# Altium schematic sheet 16 Ethernet.SchDoc
size 420 x 297 mm
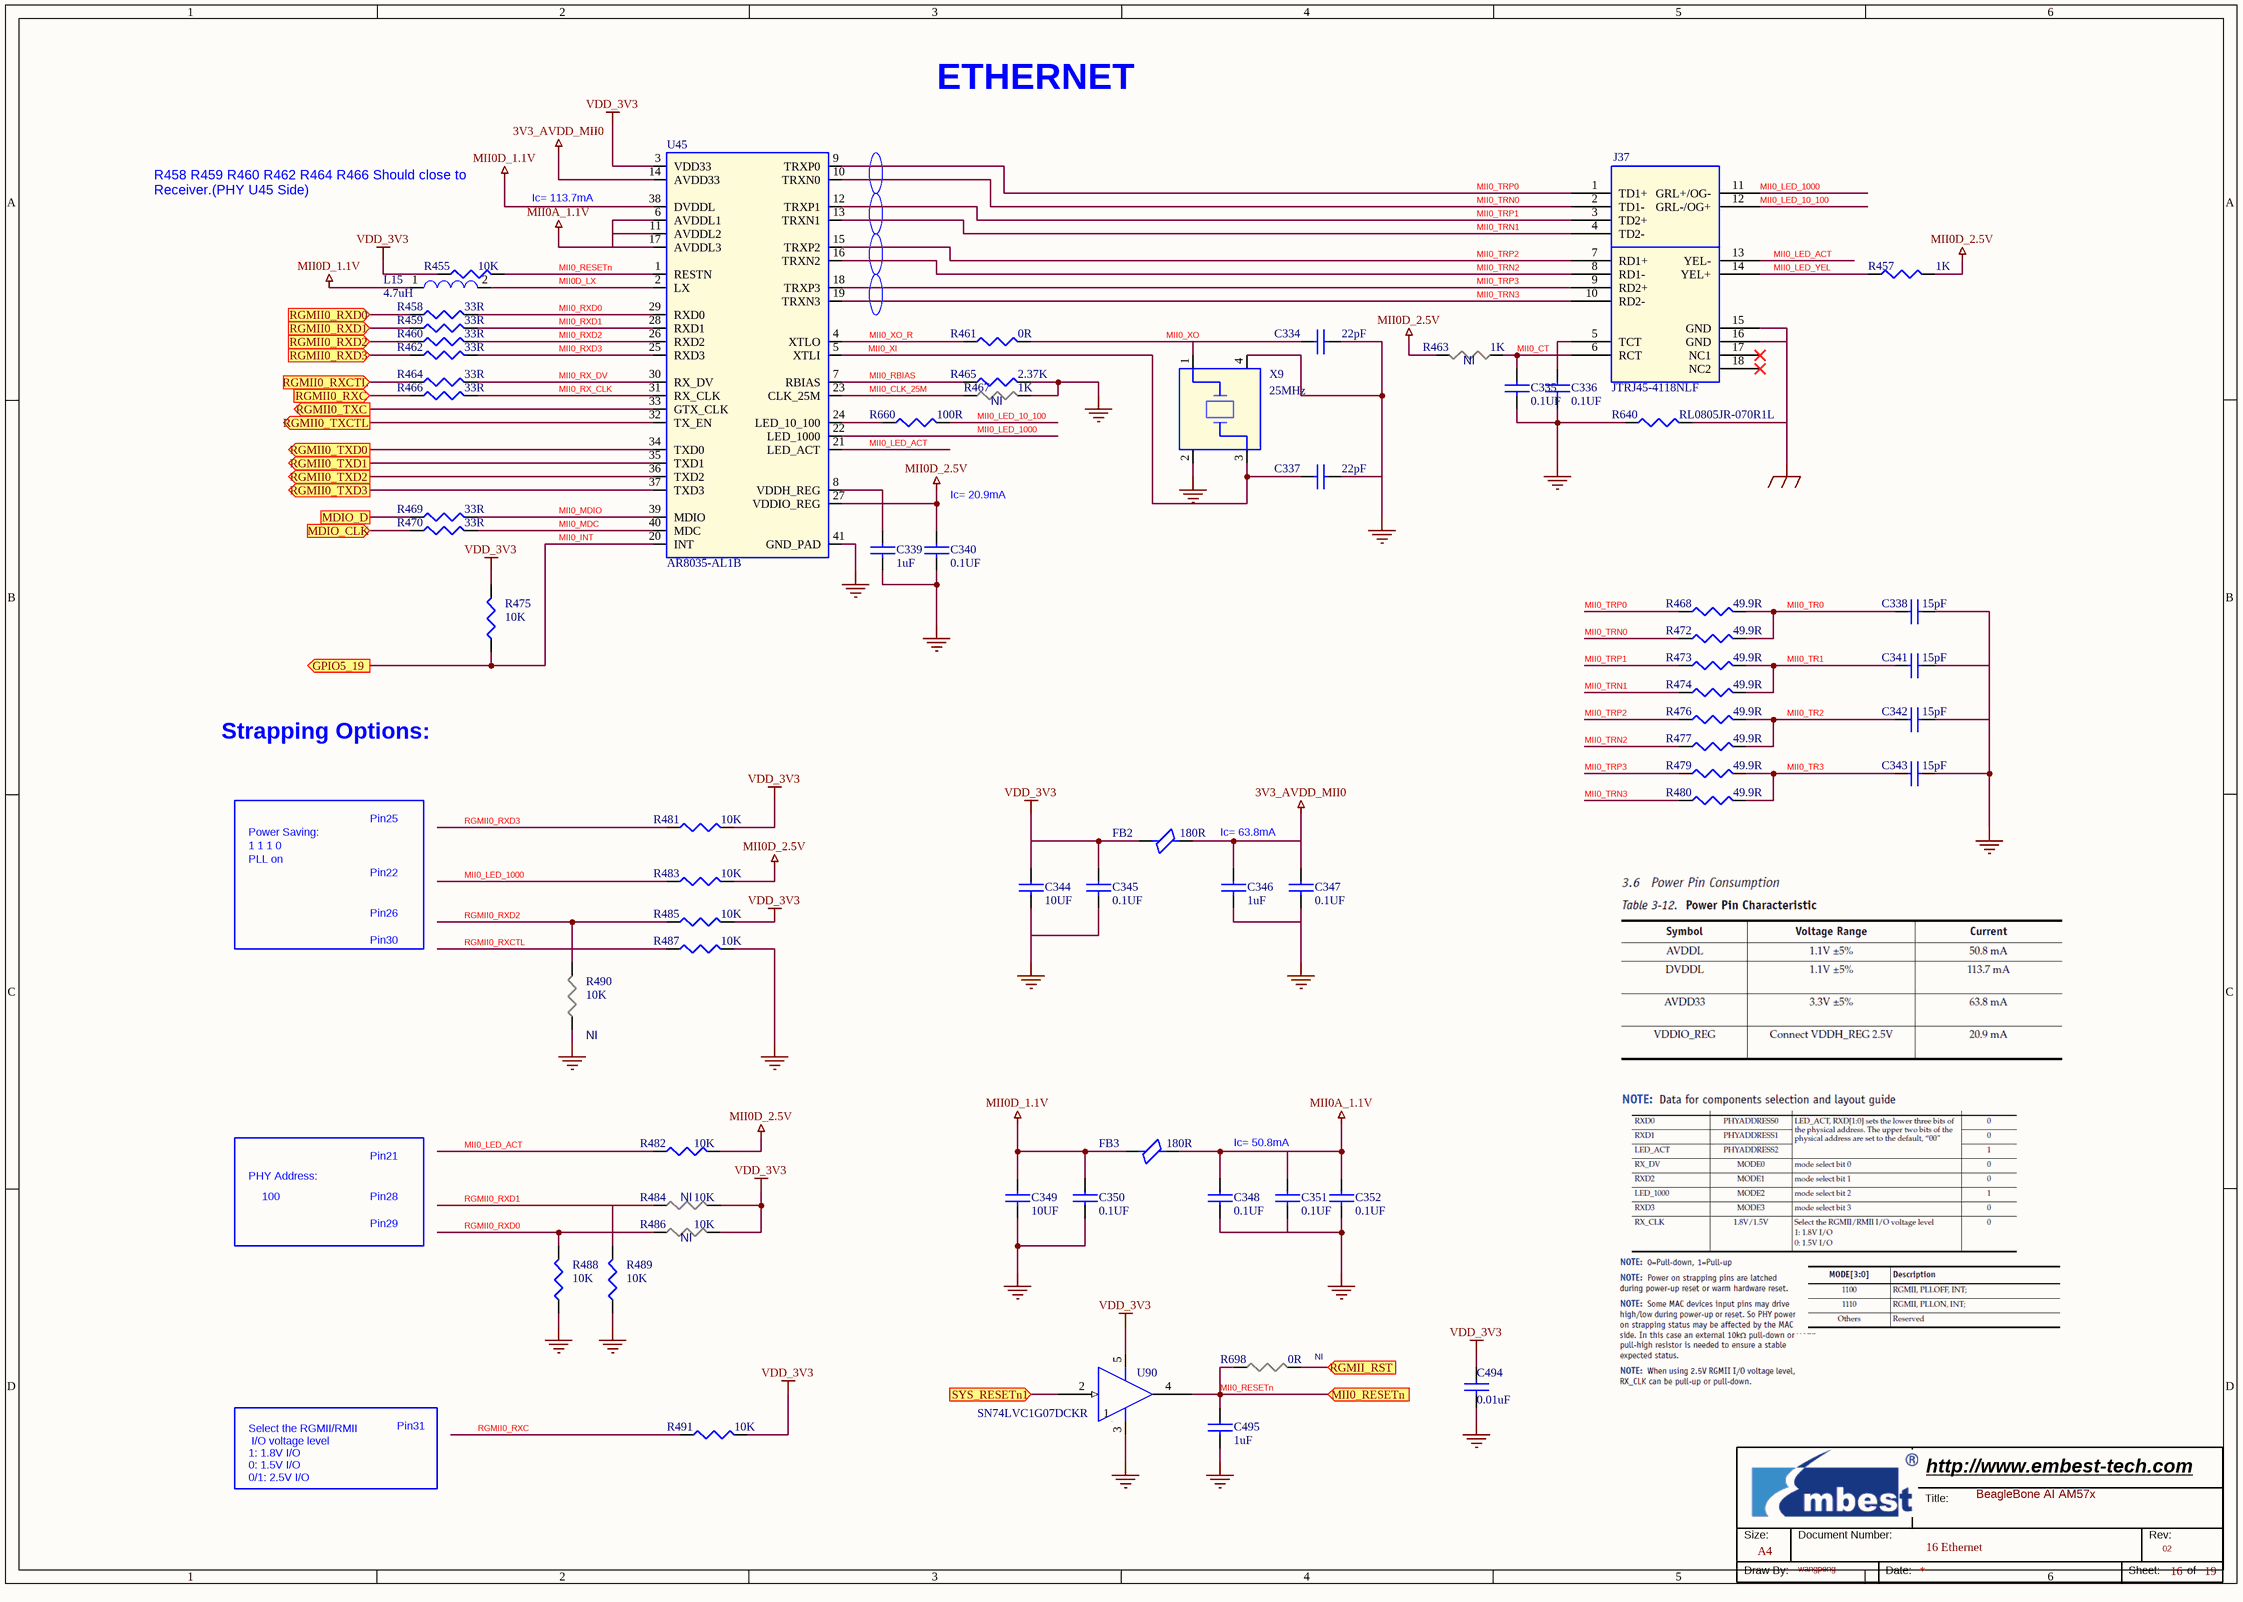
[diagram p0: 16 Ethernet.SchDoc]

## Parts
*  Page Count: 19  Page Number: 16  Page Size: A4  Title: BeagleBone AI AM57x  RevCode: 02  Doc: 16 Ethernet  Drawing: wangpeng  (hidden comment: Embest Title)  (graphical)
C334  22pF  [C0402]
C335  0.1UF  [C0402]
C336  0.1UF  [C0402]
C337  22pF  [C0402]
C338  15pF  [C0402]
C339  1uF  [C0402]
C340  0.1UF  [C0402]
C341  15pF  [C0402]
C342  15pF  [C0402]
C343  15pF  [C0402]
C344  10UF  [C0603]
C345  0.1UF  [C0402]
C346  1uF  [C0402]
C347  0.1UF  [C0402]
C348  0.1UF  [C0402]
C349  10UF  [C0603]
C350  0.1UF  [C0402]
C351  0.1UF  [C0402]
C352  0.1UF  [C0402]
C494  0.01uF  [C0402]
C495  1uF  [C0402]
FB2  180R  [L0603]
FB3  180R  [L0603]
J37  JTRJ45-4118NLF  [RJ45_MTCONN_JTRJ45-4118NLF]
L15  4.7uH  [L30X30_A]
R455  10K  [R0402]
R457  1K  [R0402]
R458  33R  [R0402]
R459  33R  [R0402]
R460  33R  [R0402]
R461  0R  [R0402]
R462  33R  [R0402]
R463  1K  ASSY: NI  [R0402]
R464  33R  [R0402]
R465  2.37K  [R0402]
R466  33R  [R0402]
R467  1K  ASSY: NI  [R0402]
R468  49.9R  [R0402]
R469  33R  [R0402]
R470  33R  [R0402]
R472  49.9R  [R0402]
R473  49.9R  [R0402]
R474  49.9R  [R0402]
R475  10K  [R0402]
R476  49.9R  [R0402]
R477  49.9R  [R0402]
R479  49.9R  [R0402]
R480  49.9R  [R0402]
R481  10K  [R0402]
R482  10K  [R0402]
R483  10K  [R0402]
R484  10K  ASSY: NI  [R0402]
R485  10K  [R0402]
R486  10K  ASSY: NI  [R0402]
R487  10K  [R0402]
R488  10K  [R0402]
R489  10K  [R0402]
R490  10K  ASSY: NI  [R0402]
R491  10K  [R0402]
R640  RL0805JR-070R1L  [R0805]
R660  100R  [R0402]
R698  0R  ASSY: NI  [R0402]
U45  AR8035-AL1B  [QFN40_1P4H]
U90  SN74LVC1G07DCKR  [SC70_5]
X9  25MHz  [OSCCC250x200x60-4N]

## Ports
GPIO5_19 (out), MDIO_CLK (in), MDIO_D, MII0_RESETn (in), RGMII0_RXC (in), RGMII0_RXCTL (in), RGMII0_RXD0 (in), RGMII0_RXD1 (in), RGMII0_RXD2 (in), RGMII0_RXD3 (in), RGMII0_TXC (out), RGMII0_TXCTL (out), RGMII0_TXD0 (out), RGMII0_TXD1 (out), RGMII0_TXD2 (out), RGMII0_TXD3 (out), RGMII_RST (in), SYS_RESETn1 (in)

## Nets
3V3_AVDD_MII0: C346.1 C347.1 FB2.2 U45.14(AVDD33)
GND: C334.2 C335.2 C336.2 C337.2 C338.2 C339.2 C340.2 C341.2 C342.2 C343.2 C344.2 C345.2 C346.2 C347.2 C348.2 C349.2 C350.2 C351.2 C352.2 C494.2 C495.2 R465.2 R467.2 R487.2 R488.1 R489.1 R490.1 R640.1 U45.41(GND_PAD) U90.3(GND) X9.2 X9.4
GND_EARTH: J37.15(GND) J37.16(GND) R640.2
MII0A_1.1V: C348.1 C351.1 C352.1 FB3.2 U45.6(AVDDL1) U45.11(AVDDL2) U45.17(AVDDL3)
MII0D_1.1V: C349.1 C350.1 FB3.1 L15.1 U45.38(DVDDL)
MII0D_2.5V: C340.1 R457.2 R463.2 R482.2 R483.2 U45.27(VDDIO_REG)
VDD_3V3: C344.1 C345.1 C494.1 FB2.1 R455.1 R475.2 R481.2 R484.2 R485.2 R486.2 R491.2 U45.3(VDD33) U90.5(VCC)
MDIO_CLK: R470.1 ; port MDIO_CLK
MDIO_D: R469.1 ; port MDIO_D
MII0_CLK_25M: R467.1 U45.23(CLK_25M)
MII0_CT: C335.1 J37.6(RCT) R463.1
MII0_INT: R475.1 U45.20(INT) ; port GPIO5_19
MII0_LED_10_100: J37.12(GRL-/OG+) R660.2
MII0_LED_1000: J37.11(GRL+/OG-) R483.1 U45.22(LED_1000)
MII0_LED_ACT: J37.13(YEL-) R482.1 U45.21(LED_ACT)
MII0_LED_YEL: J37.14(YEL+) R457.1
MII0_MDC: R470.2 U45.40(MDC)
MII0_MDIO: R469.2 U45.39(MDIO)
MII0_RBIAS: R465.1 U45.7(RBIAS)
MII0_RESETn: C495.1 R455.2 R698.1 U45.1(RESTN) U90.4(Y) ; port MII0_RESETn
MII0_RX_CLK: R466.2 U45.31(RX_CLK)
MII0_RX_DV: R464.2 U45.30(RX_DV)
MII0_RXD0: R458.2 U45.29(RXD0)
MII0_RXD1: R459.2 U45.28(RXD1)
MII0_RXD2: R460.2 U45.26(RXD2)
MII0_RXD3: R462.2 U45.25(RXD3)
MII0_TR0: C338.1 R468.2 R472.2
MII0_TR1: C341.1 R473.2 R474.2
MII0_TR2: C342.1 R476.2 R477.2
MII0_TR3: C343.1 R479.2 R480.2
MII0_TRN0: J37.2(TD1-) R472.1 U45.10(TRXN0)
MII0_TRN1: J37.4(TD2-) R474.1 U45.13(TRXN1)
MII0_TRN2: J37.8(RD1-) R477.1 U45.16(TRXN2)
MII0_TRN3: J37.10(RD2-) R480.1 U45.19(TRXN3)
MII0_TRP0: J37.1(TD1+) R468.1 U45.9(TRXP0)
MII0_TRP1: J37.3(TD2+) R473.1 U45.12(TRXP1)
MII0_TRP2: J37.7(RD1+) R476.1 U45.15(TRXP2)
MII0_TRP3: J37.9(RD2+) R479.1 U45.18(TRXP3)
MII0_XI: C337.1 U45.5(XTLI) X9.3
MII0_XO: C334.1 R461.2 X9.1
MII0_XO_R: R461.1 U45.4(XTLO)
MII0D_LX: L15.2 U45.2(LX)
RGMII0_RXC: R466.1 ; port RGMII0_RXC
RGMII0_RXC: R491.1  [a separate net that carries the same name]
RGMII0_RXCTL: R487.1
RGMII0_RXCTL: R464.1 ; port RGMII0_RXCTL  [a separate net that carries the same name]
RGMII0_RXD0: R486.1 R488.2
RGMII0_RXD0: R458.1 ; port RGMII0_RXD0  [a separate net that carries the same name]
RGMII0_RXD1: R484.1 R489.2
RGMII0_RXD1: R459.1 ; port RGMII0_RXD1  [a separate net that carries the same name]
RGMII0_RXD2: R460.1 ; port RGMII0_RXD2
RGMII0_RXD2: R485.1 R490.2  [a separate net that carries the same name]
RGMII0_RXD3: R481.1
RGMII0_RXD3: R462.1 ; port RGMII0_RXD3  [a separate net that carries the same name]
RGMII0_TXC: U45.33(GTX_CLK) ; port RGMII0_TXC
RGMII0_TXCTL: U45.32(TX_EN) ; port RGMII0_TXCTL
RGMII0_TXD0: U45.34(TXD0) ; port RGMII0_TXD0
RGMII0_TXD1: U45.35(TXD1) ; port RGMII0_TXD1
RGMII0_TXD2: U45.36(TXD2) ; port RGMII0_TXD2
RGMII0_TXD3: U45.37(TXD3) ; port RGMII0_TXD3
RGMII_RST: R698.2 ; port RGMII_RST
SYS_RESETn1: U90.2(A) ; port SYS_RESETn1
NetC336_1: C336.1 J37.5(TCT)
NetC339_1: C339.1 U45.8(VDDH_REG)
NetR660_1: R660.1 U45.24(LED_10_100)

Not connected (* = marked no-connect by the designer): J37 17(NC1)* 18(NC2)*; U90 1(NC)

## Notes on the sheet
- ETHERNET
- R458 R459 R460 R462 R464 R466 Should close to
  Receiver.(PHY U45 Side)
- Ic= 113.7mA
- Ic= 20.9mA
- Strapping Options:
- PLL on
- Power Saving:
- 1 1 1 0
- Pin25
- Ic= 63.8mA
- Pin26
- Pin22
- Pin30
- PHY Address:
- 100
- Pin28
- Pin21
- Ic= 50.8mA
- Pin29
- Select the RGMII/RMII
  I/O voltage level
  1: 1.8V I/O
  0: 1.5V I/O
  0/1: 2.5V I/O
- Pin31
- (in symbol Embest Title) Title:; Size:; Document Number:; Rev:; Draw By:; Date:; Sheet:; of

## Library data of the parts
C334 C337 = C: CAP,22PF,+/-5%,C0G,50V,SMD0402; Manufacturer: Murata; Manufacturer Part Number: GRM1555C1H220JA01D; Embest PN: 1004001100011; Part Type: Ceramic Capacitor
C335 C340 C347 C350 = C: CAP,100NF,+/-10%,X7R,16V,SMD0402; Manufacturer: Murata; Manufacturer Part Number: GRM155R71C104KA88D; Embest PN: 1004001100047; Part Type: Ceramic Capacitor; Datasheet: Y:\ÐÂK3ÏµÍ³ÎïÁÏdatasheet\[1003_1004]capacitor-resistor µçÈÝ¡¢µç×è\1004001100047-GRM155R71C104KA88D.pdf
C336 C345 C348 C351 C352 = C: CAP,100NF,+/-10%,X7R,16V,SMD0402; Manufacturer Part Number: GRM155R71C104KA88D; Manufacturer: Murata; Embest PN: 1004001100047; Datasheet: Y:\ÐÂK3ÏµÍ³ÎïÁÏdatasheet\[1003_1004]capacitor-resistor µçÈÝ¡¢µç×è\1004001100047-GRM155R71C104KA88D.pdf; Part Type: Ceramic Capacitor
C338 C341-C343 = C: CAP,15pF,+/-2%,C0G,50V,SMD0402; Manufacturer: Murata; Manufacturer Part Number: GRM1555C1H150GA01D; Embest PN: 1004001100319; Part Type: Ceramic Capacitor; Datasheet: Y:\ÐÂK3ÏµÍ³ÎïÁÏdatasheet\[1003_1004]capacitor-resistor µçÈÝ¡¢µç×è\1004001100319 GRM1555C1H150GA01DMurata.pdf
C339 = C: CAP,1UF,+/-10%,X5R,10V,SMD0402; Manufacturer: Murata; Manufacturer Part Number: GRM155R61A105KE15D; Embest PN: 1004001100057; Part Type: Ceramic Capacitor
C344 = C: CAP,10UF,+/-10%,X5R,10V,SMD0603; Manufacturer: Murata; Manufacturer Part Number: GRM188R61A106KE69D; Embest PN: 1004001100129; Part Type: Ceramic Capacitor; Datasheet: Y:\ÐÂK3ÏµÍ³ÎïÁÏdatasheet\[1003_1004]capacitor-resistor µçÈÝ¡¢µç×è\1004001100129T2 C1608X5R1A106M.pdf
C346 C495 = C: CAP,1UF,+/-10%,X5R,10V,SMD0402; Manufacturer Part Number: GRM155R61A105KE15D; Manufacturer: Murata; Embest PN: 1004001100057; Part Type: Ceramic Capacitor
C349 = C: CAP,10UF,+/-10%,X5R,10V,SMD0603; Manufacturer Part Number: GRM188R61A106KE69D; Manufacturer: Murata; Embest PN: 1004001100129; Datasheet: Y:\ÐÂK3ÏµÍ³ÎïÁÏdatasheet\[1003_1004]capacitor-resistor µçÈÝ¡¢µç×è\1004001100129T2 C1608X5R1A106M.pdf; Part Type: Ceramic Capacitor
C494 = C: CAP,10NF,+/-10%,X7R,16V,SMD0402; Manufacturer: MURATA; Manufacturer Part Number: GRM155R71C103KA01D; Embest PN: 1004001100039; Part Type: Ceramic Capacitor
FB2 = FB: Ferrite Bead,180ohm@100MHz,+/-25%,1500mA,0.09ohm,SMD0603; Manufacturer: Murata; Manufacturer Part Number: BLM18PG181SN1D; Embest PN: 1005005100012; Part Type: Ferrite Bead
FB3 = FB: Ferrite Bead,180ohm@100MHz,+/-25%,1500mA,0.09ohm,SMD0603; Manufacturer Part Number: BLM18PG181SN1D; Manufacturer: Murata; Embest PN: 1005005100012; Part Type: Ferrite Bead
J37 = JTRJ45-4118NLF: Connector,RJ45 Jack with integrated magnetics and Y/G/Y Three leds,Right Angle,1000M,Gold Flash 6u,Black,21.35x15.95x13.50MM,DIP; Manufacturer: MTCONN; Embest PN: 1009023100008; Datasheet: Y:\ÐÂK3ÏµÍ³ÎïÁÏdatasheet\[1009]connectors Á¬½ÓÆ÷\1009023100008 JTRJ45-4118NLF.pdf; Status: Hamster AM572x; Manufacturer Part Number: JTRJ45-4118NLF; Part Type: Modular jack
L15 = L: Power Inductor,Magnetic shielded,4.7uH,1.2A,0.14ohm,3X3X1.8mm,SMD; Manufacturer: Sumida; Manufacturer Part Number: CDRH2D18/HPNP-4R7NC; Embest PN: 1005004100062; Part Type: Power Inductor; Datasheet: Y:\ÐÂK3ÏµÍ³ÎïÁÏdatasheet\[1005]beads-inductors ´ÅÖé¡¢µç¸Ð\1005004100062_CDRH2D18HP_SUMIDA.pdf
R455 R475 R483 R484 R486 R488 R490 = R: RES,10K,+/-1%,1/16W,SMD0402; Manufacturer: YAGEO; Manufacturer Part Number: RC0402FR-0710KL; Embest PN: 1003001100071; Part Type: Thick film Resistor
R457 R463 = R: RES,1K,+/-1%,1/16W,SMD0402; Manufacturer: YAGEO; Manufacturer Part Number: RC0402FR-071KL; Embest PN: 1003001100034; Part Type: Thick film Resistor
R458-R460 R462 R464 = R: RES,33R,+/-5%,1/16W,SMD0402; Manufacturer: YAGEO; Manufacturer Part Number: RC0402JR-0733RL; Embest PN: 1003001100010; Part Type: Thick film Resistor
R461 = R: RES,0R,+/-5%,1/16W,SMD0402; Manufacturer Part Number: RC0402JR-070RL; Manufacturer: YAGEO; Embest PN: 1003001100001; Part Type: Thick film Resistor
R465 = R: RES,2K37,+/-1%,1/16W,SMD0402; Manufacturer: YAGEO; Manufacturer Part Number: RC0402FR-072K37L; Embest PN: 1003001100047; Part Type: Thick film Resistor
R466 R469 R470 = R: RES,33R,+/-5%,1/16W,SMD0402; Manufacturer Part Number: RC0402JR-0733RL; Manufacturer: YAGEO; Embest PN: 1003001100010; Part Type: Thick film Resistor
R467 = R: RES,1K,+/-1%,1/16W,SMD0402; Manufacturer Part Number: RC0402FR-071KL; Manufacturer: YAGEO; Embest PN: 1003001100034; Part Type: Thick film Resistor
R468 R472-R474 R476 R477 R479 R480 = R: RES,49R9,+/-1%,1/16W,SMD0402; Manufacturer Part Number: RC0402FR-0749R9L; Manufacturer: YAGEO; Embest PN: 1003001100015; Part Type: Thick film Resistor; VPN: RC0402FR-0749R9L
R481 R482 R485 R487 R489 R491 = R: RES,10K,+/-1%,1/16W,SMD0402; Manufacturer Part Number: RC0402FR-0710KL; Manufacturer: YAGEO; Embest PN: 1003001100071; Part Type: Thick film Resistor
R640 = R: RES,0R1,+/-5%,1/8W,SMD0805; Manufacturer: Yageo; Rating: <Rating>; Embest PN: 1003001100451; Status: TBD; Manufacturer Part Number: RL0805JR-070R1L; Part Type: Thick film Resistor
R660 = R: RES,100R,+/-5%,1/16W,SMD0402; Manufacturer Part Number: RC0402JR-07100RL; Manufacturer: YAGEO; Embest PN: 1003001100020; Part Type: Thick film Resistor
R698 = R: RES,0R,+/-5%,1/16W,SMD0402; Manufacturer: YAGEO; Manufacturer Part Number: RC0402JR-070RL; Embest PN: 1003001100001; Part Type: Thick film Resistor
U45 = AR8035: IC,Ultra low-power single RGMII Gigabit Ethernet PHY,AR8035,QFN-40,SMD; Manufacturer: ATHEROS; Embest PN: 1002016100028; Part Type: Ethernet; Manufacturer Part Number: AR8035-AL1B; Datasheet: Y:\ÐÂK3ÏµÍ³ÎïÁÏdatasheet\[1002]IC ¼¯³ÉµçÂ·\1002016100028 AR8035-AL1B.pdf
U90 = SN74LVC1G07DCKR: IC,SINGLE BUFFER/DRIVER WITH OPEN-DRAIN OUTPUT,SN74LVC1G07DCKR,SC-70,SMD; Manufacturer: TI; Embest PN: 1002008100087; Part Type: Logic; Manufacturer Part Number: SN74LVC1G07DCKR; Datasheet: Y:\ÐÂK3ÏµÍ³ÎïÁÏdatasheet\[1002]IC ¼¯³ÉµçÂ·\1002008100087 sn74lvc1g07 ti.pdf
X9 = X4: Crystal,5ZAA25000202TFA0Q3,25MHz,+/-20PPM,20PF,2520-4 pads,SMD; Manufacturer: INTERQUIP; Embest PN: 1008002100255; Rating: 20PPM; Part Type: Crystal; Manufacturer Part Number: 5ZAA25000202TFA0Q3; Status: Hamster AM572x; Datasheet: Y:\ÐÂK3ÏµÍ³ÎïÁÏdatasheet\[1008]crystal ¾§Ìå\1008002100255 5ZAA25000202TFA0Q3¹æ¸ñÊé.pdf
* = Embest Title: Page Create Date: May 29, 2006; WebSite: http://www.embest-tech.com; Company: Embest; Page Modify Date: *